# Altium schematic sheet STM32.SchDoc
size A3
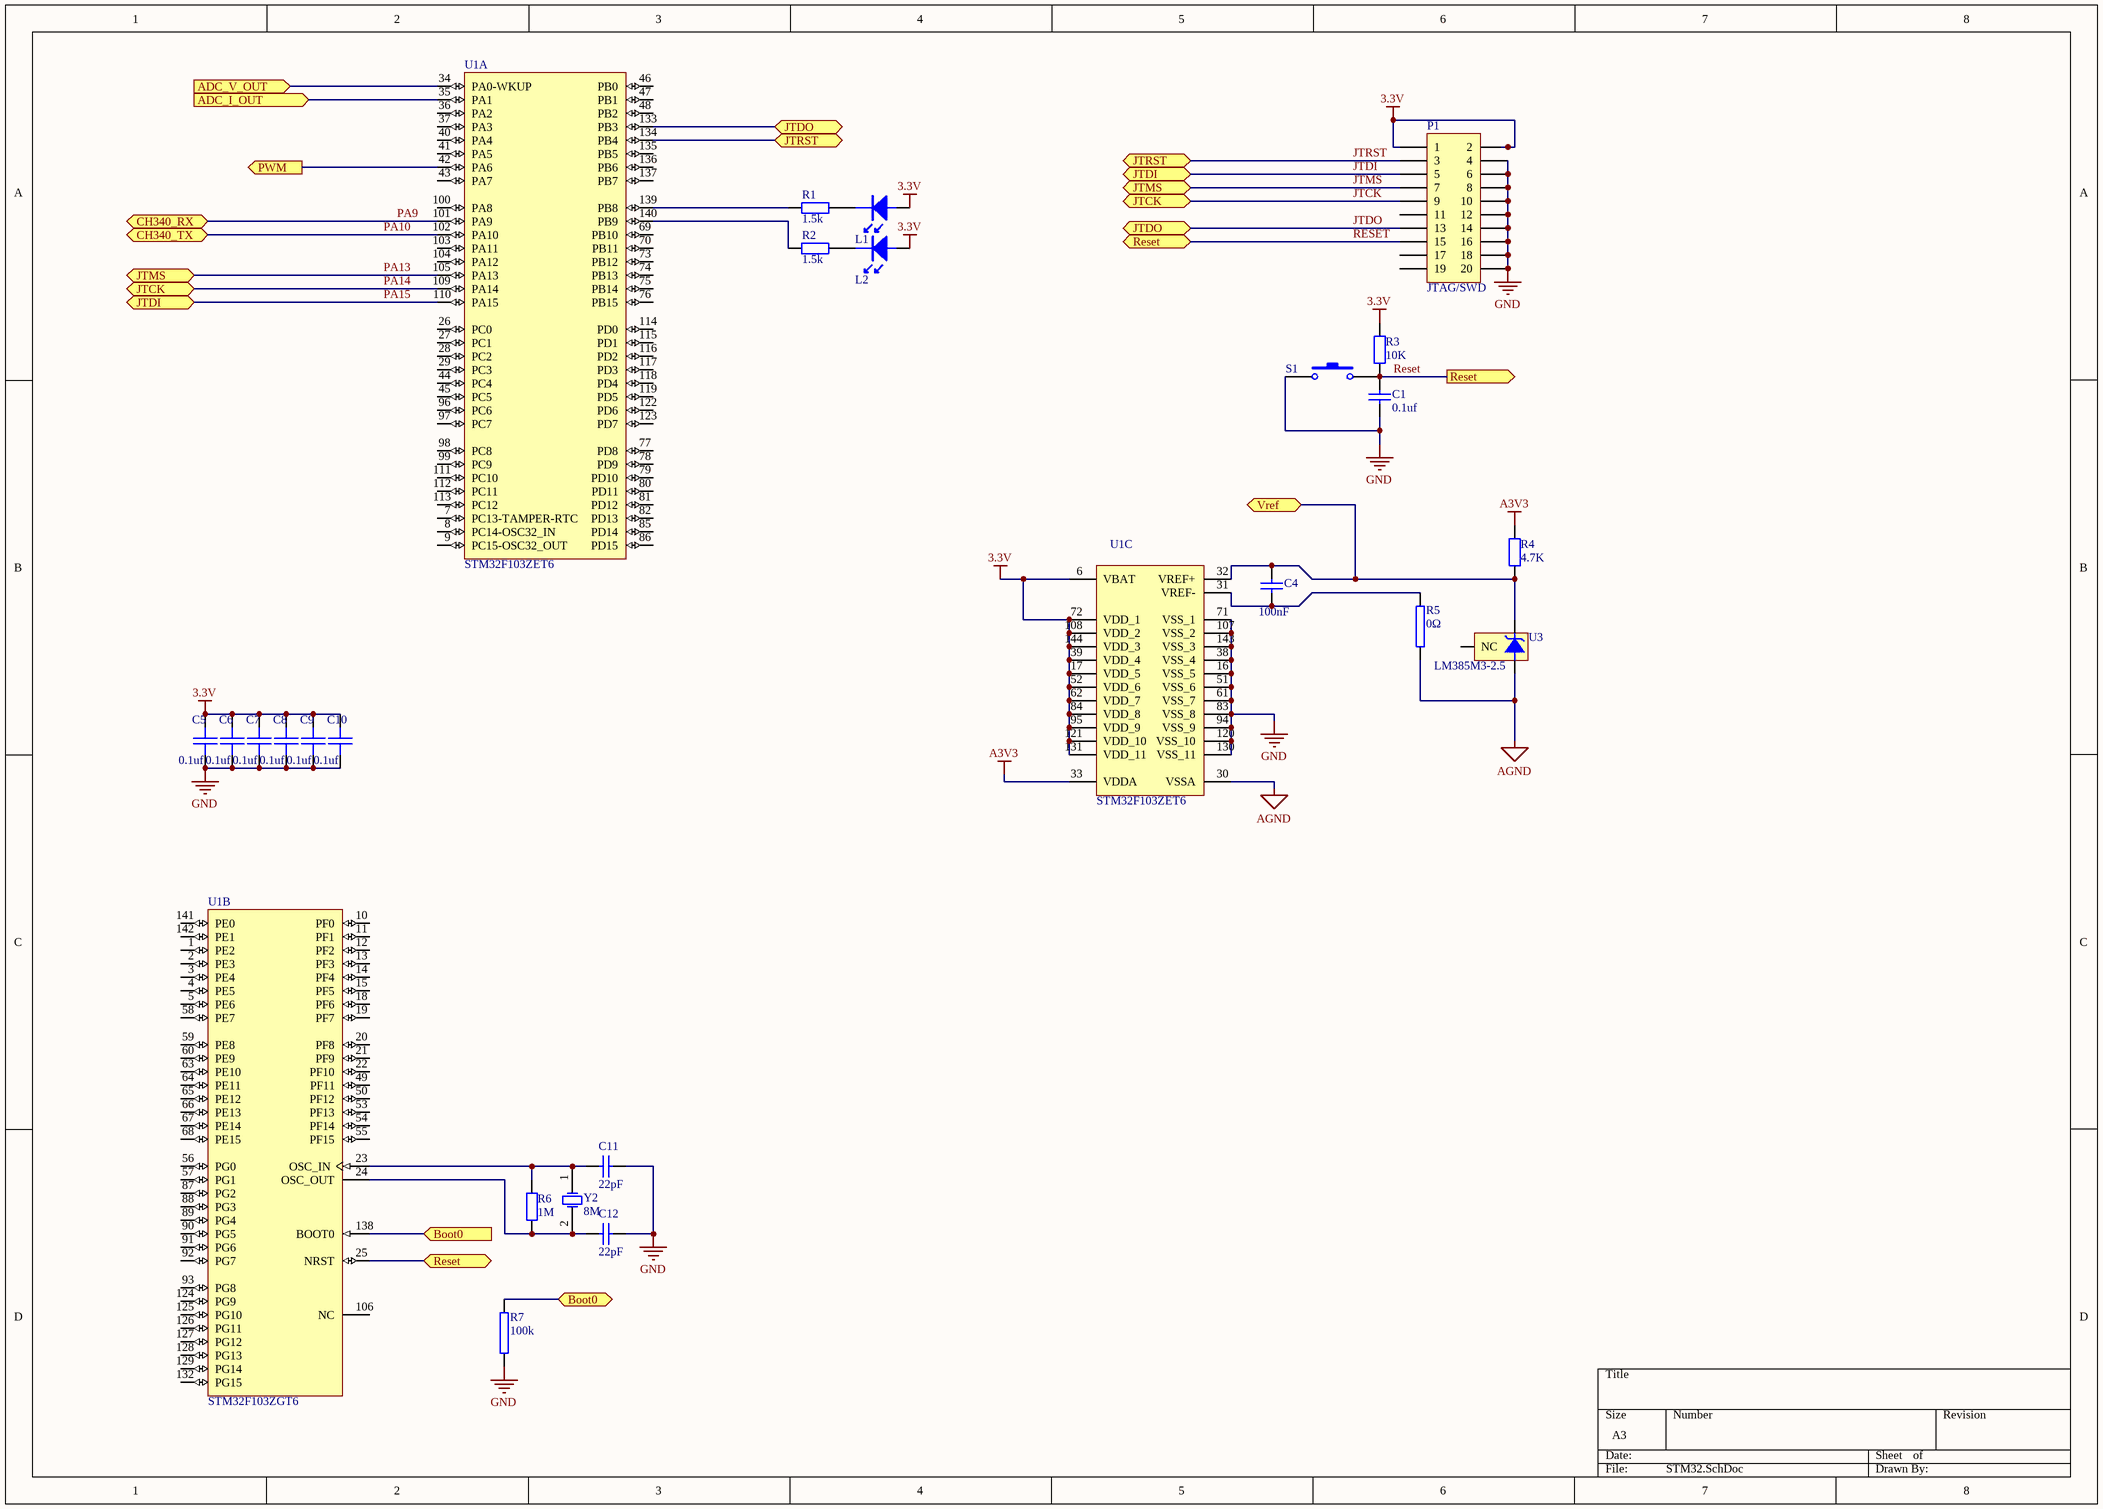
[diagram p0: STM32.SchDoc]

## Parts
C1  0.1uf  [0805R]
C4  100nF  [C-RAD-0805]
C5  0.1uf  [0805]
C6  0.1uf  [0805]
C7  0.1uf  [0805]
C8  0.1uf  [0805]
C9  0.1uf  [0805]
C10  0.1uf  [0805]
C11  22pF  [0805R]
C12  22pF  [0805R]
L1  POWER  [LED-0805]  (value not drawn)
L2  POWER  [LED-0805]  (value not drawn)
P1  JTAG/SWD  [JTAG_20]
R1  1.5k  [0805R]
R2  1.5k  [0805R]
R3  10K  [0805R]
R4  4.7K  [0805R]
R5  0Ω  [0805R]
R6  1M  [0805R]
R7  100k  [0805R]
S1  SW-PB  [SW_PB2_A1]  (value not drawn)
U1  STM32F103ZET6  [STM-LQFP144_N]  (parts A,B,C of 3)
U3  LM385M3-2.5  [MF03A_N]
Y2  8M  [晶振]

## Ports
ADC_I_OUT (in), ADC_V_OUT (in), Boot0 (bidir), Boot0 (in), CH340_RX (bidir), CH340_TX (bidir), JTCK (bidir), JTDI (bidir), JTDO (bidir), JTMS (bidir), JTRST (bidir), PWM (out), Reset (bidir), Reset (out), Vref (bidir)

## Nets
3.3V: C5.2 C6.2 C7.2 C8.2 C9.2 C10.2 L1.1 L2.1 P1.1 P1.2 R3.1 U1.6(VBAT) U1.17(VDD_5) U1.39(VDD_4) U1.52(VDD_6) U1.62(VDD_7) U1.72(VDD_1) U1.84(VDD_8) U1.95(VDD_9) U1.108(VDD_2) U1.121(VDD_10) U1.131(VDD_11) U1.144(VDD_3)
A3V3: R4.1 U1.33(VDDA)
AGND: R5.1 U1.30(VSSA) U3.2(-V)
GND: C1.1 C5.1 C6.1 C7.1 C8.1 C9.1 C10.1 C11.1 C12.1 P1.4 P1.6 P1.8 P1.10 P1.12 P1.14 P1.16 P1.18 P1.20 R7.1 S1.1 U1.16(VSS_5) U1.38(VSS_4) U1.51(VSS_6) U1.61(VSS_7) U1.71(VSS_1) U1.83(VSS_8) U1.94(VSS_9) U1.107(VSS_2) U1.120(VSS_10) U1.130(VSS_11) U1.143(VSS_3)
ADC_I_OUT: U1.35(PA1) ; port ADC_I_OUT
ADC_V_OUT: U1.34(PA0-WKUP) ; port ADC_V_OUT
Boot0: R7.2 U1.138(BOOT0) ; port Boot0
JTCK: P1.9 U1.109(PA14) ; port JTCK  [also labelled PA14]
JTDI: P1.5 U1.110(PA15) ; port JTDI  [also labelled PA15]
JTDO: P1.13 U1.133(PB3) ; port JTDO
JTMS: P1.7 U1.105(PA13) ; port JTMS  [also labelled PA13]
JTRST: P1.3 U1.134(PB4) ; port JTRST
PA9: U1.101(PA9) ; port CH340_RX
PA10: U1.102(PA10) ; port CH340_TX
PWM: U1.42(PA6) ; port PWM
Reset: C1.2 P1.15 R3.2 S1.2 U1.25(NRST) ; port Reset
Vref: C4.2 R4.2 U1.32(VREF+) U3.1(+V) ; port Vref
NetC4_1: C4.1 R5.2 U1.31(VREF-)
NetC11_2: C11.2 R6.1 U1.23(OSC_IN) Y2.1(OSC1)
NetC12_2: C12.2 R6.2 U1.24(OSC_OUT) Y2.2(OSC2)
NetL1_2: L1.2 R1.2
NetL2_2: L2.2 R2.2
NetR1_1: R1.1 U1.139(PB8)
NetR2_1: R2.1 U1.140(PB9)

Not connected (* = marked no-connect by the designer): P1 11 17 19; U1 1(PE2) 2(PE3) 3(PE4) 4(PE5) 5(PE6) 7(PC13-TAMPER-RTC) 8(PC14-OSC32_IN) 9(PC15-OSC32_OUT) 10(PF0) 11(PF1) 12(PF2) 13(PF3) 14(PF4) 15(PF5) 18(PF6) 19(PF7) 20(PF8) 21(PF9) 22(PF10) 26(PC0) 27(PC1) 28(PC2) 29(PC3) 36(PA2) 37(PA3) 40(PA4) 41(PA5) 43(PA7) 44(PC4) 45(PC5) 46(PB0) 47(PB1) 48(PB2) 49(PF11) 50(PF12) 53(PF13) 54(PF14) 55(PF15) 56(PG0) 57(PG1) 58(PE7) 59(PE8) 60(PE9) 63(PE10) 64(PE11) 65(PE12) 66(PE13) 67(PE14) 68(PE15) 69(PB10) 70(PB11) 73(PB12) 74(PB13) 75(PB14) 76(PB15) 77(PD8) 78(PD9) 79(PD10) 80(PD11) 81(PD12) 82(PD13) 85(PD14) 86(PD15) 87(PG2) 88(PG3) 89(PG4) 90(PG5) 91(PG6) 92(PG7) 93(PG8) 96(PC6) 97(PC7) 98(PC8) 99(PC9) 100(PA8) 103(PA11) 104(PA12) 106(NC) 111(PC10) 112(PC11) 113(PC12) 114(PD0) 115(PD1) 116(PD2) 117(PD3) 118(PD4) 119(PD5) 122(PD6) 123(PD7) 124(PG9) 125(PG10) 126(PG11) 127(PG12) 128(PG13) 129(PG14) 132(PG15) 135(PB5) 136(PB6) 137(PB7) 141(PE0) 142(PE1); U3 3(NC)

## Library data of the parts
C1 C11 C12 = Cap: Capacitor; Published: 8-Jun-2000; LatestRevisionDate: 17-Jul-2002; LatestRevisionNote: Re-released for DXP Platform.; PackageReference: RAD-0.3; Publisher: Altium Limited; PackageDescription: Radial Cap, Thru-Hole; 2 Leads; 0.3 in Pin Spacing
  C1: Value: 0.1uf
  C11 C12: Value: 22pF
C4 = Cap: 无极性电容; Published: 8-Jun-2000; LatestRevisionDate: 17-Jul-2002; LatestRevisionNote: Re-released for DXP Platform.; PackageReference: RAD-0.3; Publisher: Altium Limited; Value: 100nF
C5-C10 = CAP1_1: Capacitor; 物料代码: 1.02.01.0032; 名称: 电容; 规格型号: 104,±10%,50V,X7R,0603,*,RoHS; 封装: 0603; 设备封装名称: C0603_104_X7R_50V_10%; 贴片和直插: SMT; 现有库存: 1572305; RoHS: RoHS; ComponentLink1Description: ErpDataInfo; ComponentLink1URL: http://192.168.0.2:8012/ErpExt/ErpData/ListMateriel.aspx?pkey=1.02.01.0032; Value: 0.1uf
L1 L2 = LED1: 物料代码: 1.04.05.0001; Value: 红色,0805; 名称: 发光二极管; 规格型号: 红色,0805,0805,RoHS; 封装: 0805; 设备封装名称: LED0805-RED; 贴片和直插: SMT; 器件优选方案: 优先选用; 现有库存: 41928; RoHS: RoHS; ComponentLink1Description: ErpDataInfo; ComponentLink1URL: http://192.168.0.2:8012/ErpExt/ErpData/ListMateriel.aspx?pkey=1.04.05.0001
P1 = Header 10X2: Header, 10-Pin, Dual row; LatestRevisionDate: 17-Jul-2002; LatestRevisionNote: Re-released for DXP Platform.; Publisher: Altium Limited
R1-R4 R6 = Res2: Resistor; Published: 8-Jun-2000; LatestRevisionDate: 17-Jul-2002; LatestRevisionNote: Re-released for DXP Platform.; PackageReference: AXIAL-0.4; Publisher: Altium Limited; PackageDescription: Axial Device, Thru-Hole; 2 Leads; 0.4 in Pin Spacing
  R1 R2: Value: 1.5k
  R3: Value: 10K
  R4: Value: 4.7K
  R6: Value: 1M
R5 R7 = RES2_2: 物料代码: 1.01.02.0001; 名称: 电阻; 规格型号: 0Ω,0805,*,RoHS; 封装: 0805; 设备封装名称: R0805_0R; 贴片和直插: SMT; 现有库存: 251744; RoHS: RoHS; ComponentLink1Description: ErpDataInfo; ComponentLink1URL: http://192.168.0.2:8012/ErpExt/ErpData/ListMateriel.aspx?pkey=1.01.02.0001
  R5: Value: 0Ω
  R7: Value: 100k
S1 = SW-PB: Switch; Published: 24-Mar-1999; LatestRevisionDate: 17-Jul-2002; LatestRevisionNote: Re-released for DXP Platform.; PackageReference: SPST-2; Publisher: Altium Limited; PackageDescription: Switch; 2 Leads
U1 = STM32F103ZET6: ARM Cortex-M3 32-bit MCU, 512 KB Flash, 64 KB Internal RAM, 112 I/Os, 144-pin LQFP, -40 to 85 degC, Tray; A/D Converter: 3x12-bit (21 Channel); D/A Converter: 2x12-bit (2 Channel); FLASH Size (Prog) (kB): 512; I/Os (High Current): 112; Internal RAM Size (kB): 64; Operating Frequency(F) (Processor speed) (MHz): 72; Supply Voltage(Vcc) min (V): 2; DatasheetVersion: Rev. 8; PackageVersion: Rev. 4, 06/2013; PackageReference: LQFP144; PackageDescription: 144-Pin Low Profile Quad Flat Package, 20 x 20 mm Body, 0.5 mm Pitch; Supplier 1: Digi-Key; Supplier Part Number 1: 497-6442-ND; Supplier 2: Farnell; Supplier Part Number 2: 1624145; Supplier 3: Newark; Supplier Part Number 3: 57P1270; Supplier 4: Mouser; Supplier Part Number 4: 511-STM32F103ZET6; Core: ARM Cortex-M3; Packing: Tray; Mounting Technology: Surface Mount; PartNumber: STM32F103ZET6; ComponentLink1Description: Manufacturer URL; ComponentLink1URL: http://www.st.com/web/en/home.html; ComponentLink2Description: Datasheet; ComponentLink2URL: http://www.st.com/st-web-ui/static/active/en/resource/technical/document/datasheet/CD00191185.pdf; ComponentLink3Description: Package Specification; ComponentLink3URL: http://www.st.com/st-web-ui/static/active/en/resource/technical/document/datasheet/DM00037051.pdf
U3 = LM385M3-2.5: Micropower Voltage Reference Diode, 3-pin SOT-23; Manufacturer: National Semiconductor; PackageTopMarking: R12*XTT; PowerWise: N; CompType: Voltage Reference IC; Published: 4-Dec-2008; DatasheetVersion: Jan-2008; PackageVersion: revB, Mar-2003; PackageReference: MF03A; Publisher: Altium Limited; PackageDescription: Molded SOT-23, .115 x .051 x .037in Body, 3 Lead, .075 in Pitch; Supplier 1: Farnell; Supplier Part Number 1: 9778160RL; Supplier 2: Farnell; Supplier Part Number 2: 9778160; PartNumber: LM385M3-2.5; RoHS: N; PinCount: 3; ComponentLink1Description: LM385-2.5 Datasheet; ComponentLink1URL: http://www.national.com/ds/LM/LM385-2.5.pdf; ComponentLink2Description: LM385-2.5 Web Page; ComponentLink2URL: http://www.national.com/pf/LM/LM385-2.5.html; ComponentLink3Description: MF03A Package Page; ComponentLink3URL: http://www.national.com/packaging/folders/mf03a.html
Y2 = XTAL: Crystal Oscillator; Published: 8-Jun-2000; LatestRevisionDate: 17-Jul-2002; LatestRevisionNote: Re-released for DXP Platform.; PackageReference: R38; Publisher: Altium Limited; PackageDescription: Crystal, Thru-Hole; 2 Leads; Body 3.1 x 8.2 mm (Dia.xH)